# Altium schematic sheet KillSwitch.SchDoc: Kill Switch Circuit
size A4; Date: 4/20/2017; DrawnBy: Michael Fay; Revision: 1; SheetNumber: 2; SheetTotal: 2; File: KillSwitch.SchDoc
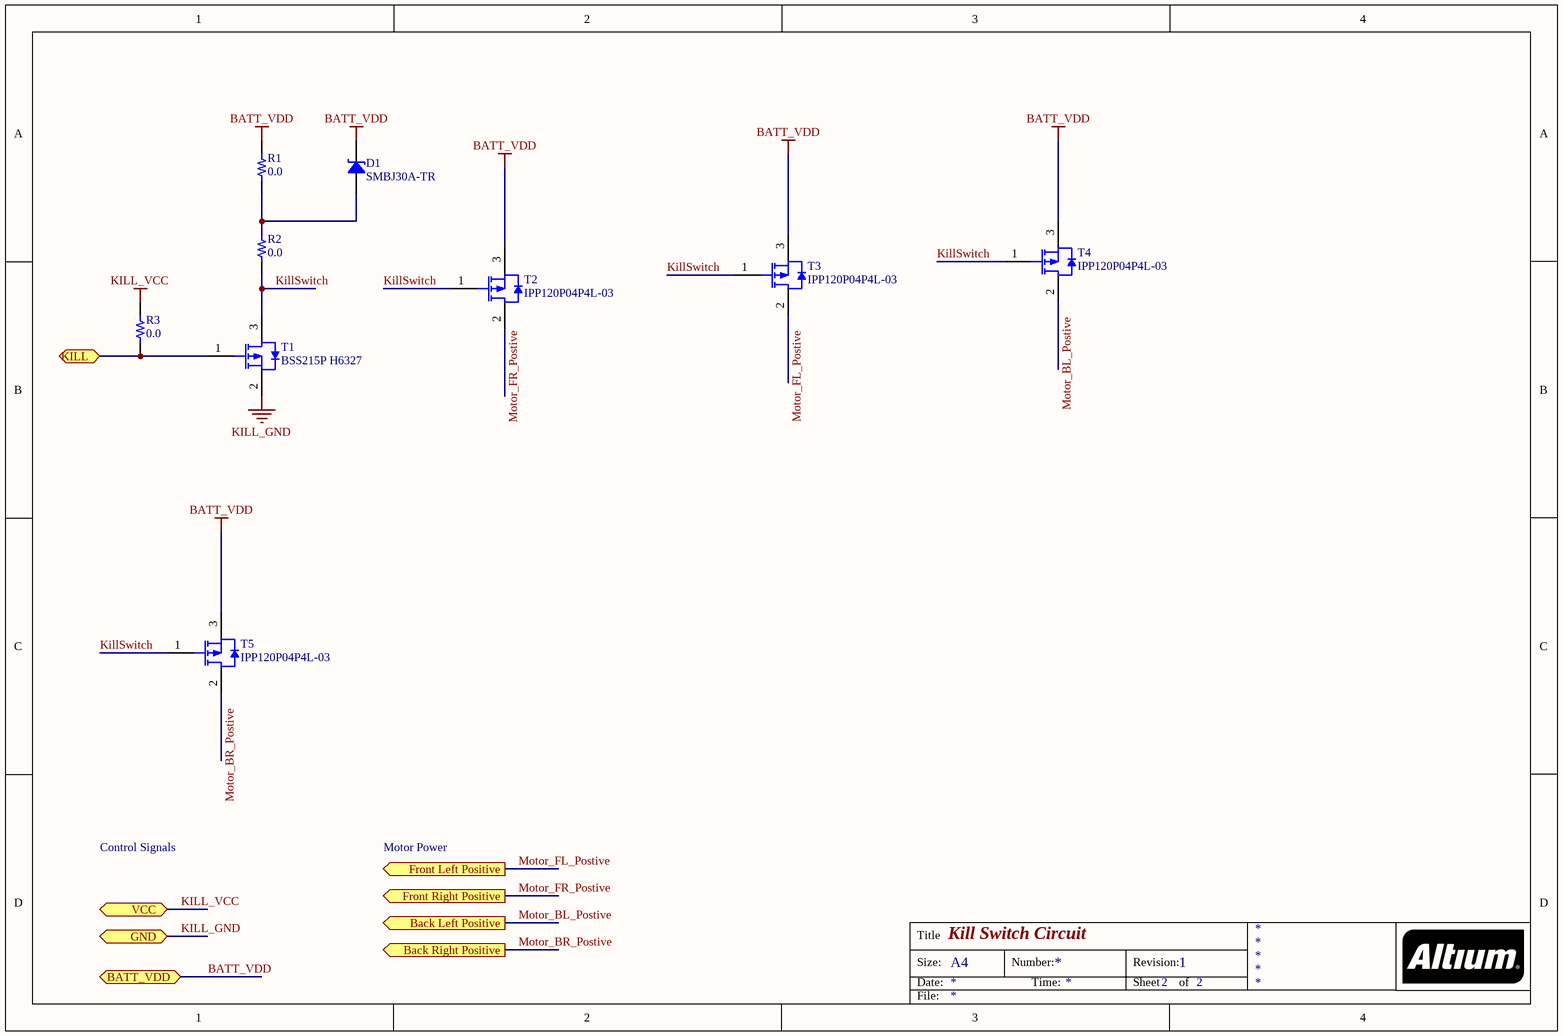
[diagram p0: KillSwitch.SchDoc]

## Parts
D1  SMBJ30A-TR  [ST DO214AA SMB]
R1  0.0  [RES 0603/1608]
R2  0.0  [RES 0603/1608]
R3  0.0  [RES 0603/1608]
T1  BSS215P H6327  [INF-PG-SOT23_N]
T2  IPP120P04P4L-03  [INF-PG-TO220-3-1]
T3  IPP120P04P4L-03  [INF-PG-TO220-3-1]
T4  IPP120P04P4L-03  [INF-PG-TO220-3-1]
T5  IPP120P04P4L-03  [INF-PG-TO220-3-1]

## Ports
Back Left Positive (out), Back Right Positive (out), BATT_VDD, Front Left Positive (out), Front Right Positive (out), GND, KILL (bidir), VCC

## Nets
BATT_VDD: D1.2 R1.2 T2.3(SOURCE) T3.3(SOURCE) T4.3(SOURCE) T5.3(SOURCE) ; port BATT_VDD
KILL_GND: T1.2(SOURCE) ; port GND
KILL_VCC: R3.2 ; port VCC
KILL: R3.1 T1.1(GATE) ; port KILL
KillSwitch: R2.1 T1.3(DRAIN) T2.1(GATE) T3.1(GATE) T4.1(GATE) T5.1(GATE)
Motor_BL_Postive: T4.2(DRAIN) ; port Back Left Positive
Motor_BR_Postive: T5.2(DRAIN) ; port Back Right Positive
Motor_FL_Postive: T3.2(DRAIN) ; port Front Left Positive
Motor_FR_Postive: T2.2(DRAIN) ; port Front Right Positive
NetD1_1: D1.1 R1.1 R2.2

## Notes on the sheet
- Control Signals
- Motor Power
- Title
- Size:
- Date:
- A4
- Number:
- Time:
- Revision:
- Sheet
- of
- File:

## Library data of the parts
D1 = SMBJ30A-TR: TVS DIODE 30VWM 64.3VC SMB; Manufacturer: STMicroelectronics; Type: Zener; Unidirectional Channels: 1; Power - Peak Pulse: 600W; Current - Peak Pulse: 62A (8/20us); Voltage (Clamping): 64.3V; Voltage (Breakdown): 33.3V; Voltage (Reverse Standoff): 30V; Part Number: SMBJ30A-TR; PartId: 14620; Supplier 1: Digi-Key; Supplier Part Number 1: 497-7452-2-ND; ComponentLink1Description: Datasheet; ComponentLink1URL: http://www2.st.com/content/ccc/resource/technical/document/datasheet/19/78/91/39/07/cd/40/65/CD00001366.pdf/files/CD00001366.pdf/_jcr_content/translations/en.CD00001366.pdf; ComponentLink2Description: Digi-Key Listing; ComponentLink2URL: https://www.digikey.com/product-detail/en/stmicroelectronics/SMBJ30A-TR/497-7452-2-ND/1039140; Operating Temperature: -55C ~ 150C (TJ); Price: 0.09; Device Package: DO-214AA, SMB
R1-R3 = 5110: RES SMD 0.0 OHM JUMPER 1/2W 0603; Part Number: 5110; Manufacturer: Keystone Electronics; PowerRating: 0.5W, 1/2W; Value: 0.0; PartId: 16115; Supplier 1: Digi-Key; Supplier Part Number 1: 36-5110TR-ND; ComponentLink1Description: Datasheet; ComponentLink1URL: http://www.keyelco.com/product-pdf.cfm?p=14038; ComponentLink2Description: Digi-Key Listing; ComponentLink2URL: https://www.digikey.com/product-detail/en/keystone-electronics/5110/36-5110TR-ND/5118870; Tolerance: Jumper; Price: 0.2505; Device Package: 0603 (1608 Metric)
T1 = BSS215P H6327: P-Channel OptiMOS P2 Small-Signal-Transistor, -20 V VDS, -1.5 A ID, -55 to 150 degC, PG-SOT23, Reel, Green; Manufacturer: Infineon; Green: TRUE; ID (max): -1.5 A; IDpuls (max): -6 A; Pto t (max): 0.5 W; QG: -3.6 nC; RDS (on) (max): 280 mOhm; RDS (on) (max) (@4.5V): 150 mOhm; Rth: 250 K/W; VDS (max): -20 V; VGS(th) (max): -0.6 V; VGS(th) (min): -1.2 V; DatasheetVersion: Rev. 2.3; PackageVersion: Apr-08; PackageReference: PG-SOT23; PackageDescription: 3-Pin Small Outline Transistor Package, 2.9 x 1.3 mm Body, 0.95 mm Pitch; Supplier 1: Digi-Key; Supplier Part Number 1: BSS215P H6327TR-ND; Supplier 2: Digi-Key; Supplier Part Number 2: BSS215P H6327CT-ND; Supplier 3: Digi-Key; Supplier Part Number 3: BSS215P H6327DKR-ND; Halogen-free: TRUE; Packing: Reel; RDS (on) (max) (@2.5V): 280 mOhm; Mounting Technology: Surface Mount; PartNumber: BSS215P H6327; ComponentLink1Description: Manufacturer URL; ComponentLink1URL: http://www.infineon.com/; ComponentLink2Description: Datasheet; ComponentLink2URL: http://www.infineon.com/dgdl/BSS215P_Rev2.3.pdf?folderId=db3a304314dca38901154a72e3951a65&fileId=db3a304330f6860601311833f57144fb; ComponentLink3Description: Package Specification; ComponentLink3URL: http://www.infineon.com/dgdl/SOT23-Package_Overview.pdf?folderId=db3a30431936bc4b0119532290053c66&fileId=db3a30431936bc4b0119533468123c85
T2-T5 = IPP120P04P4L-03: OptiMOS-P2 Power-Transistor, -40 V VDS, -120 A ID, PG-TO220-3-1, Tube, Green; Manufacturer: Infineon; Green: TRUE; ID (max): -120 A; IDpuls (max): -480 A; Ptot (max): 136 W; QG: 180 nC; RDS (on) (max) (@10V): 3.4 mOhm; RDS (on) (max) (@4.5V): 5.2 mOhm; RthJC (max): 1.1 K/W; VDS (max): -40 V; VGS(th) (max): -2.2 V; VGS(th) (min): -1.2 V; DatasheetVersion: Rev. 1.0; PackageVersion: Jul-12; PackageReference: PG-TO220-3-1; PackageDescription: 3-Pin Plastic (Green) Transistor Single Outline Package, 10 x 9.25 mm Body, 2.54 mm Pitch; Supplier 1: Mouser; Supplier Part Number 1: 726-IPP120P04P4L-03; Halogen-free: TRUE; Packing: Tube; Technology: OptiMOS-P2; Mounting Technology: Through Hole; PartNumber: IPP120P04P4L-03; ComponentLink1Description: Manufacturer URL; ComponentLink1URL: http://www.infineon.com/; ComponentLink2Description: Datasheet; ComponentLink2URL: http://www.infineon.com/dgdl/IPP_B_I120P04P4L-03_DS_10.pdf?folderId=db3a304412b407950112b42b75b74520&fileId=db3a30432f69f146012f783b3b5a2e3f&location=en.Products.Automotive_ICs.Automotive_MOSFETs.Single__P-Channel_40V_MOSFETs.DATASHEET.IPP_B_I120P04P4L-03_DS_10.pdf; ComponentLink3Description: Package Specification; ComponentLink3URL: http://www.infineon.com/dgdl/BTS117_DS_14.pdf?folderId=db3a30431400ef68011421b54e2e0564&fileId=db3a30433a747525013abff8302d549c&location=en.Products.Automotive_ICs.Smart_High-_and_Low-Side_Switches.HITFET___TEMPFET__-_Smart_Low-Side_Switches.DATASHEET.BTS117_DS_14.pdf